# EAGLE design pic24rgbdin-01 (EAGLE 7.4.0)
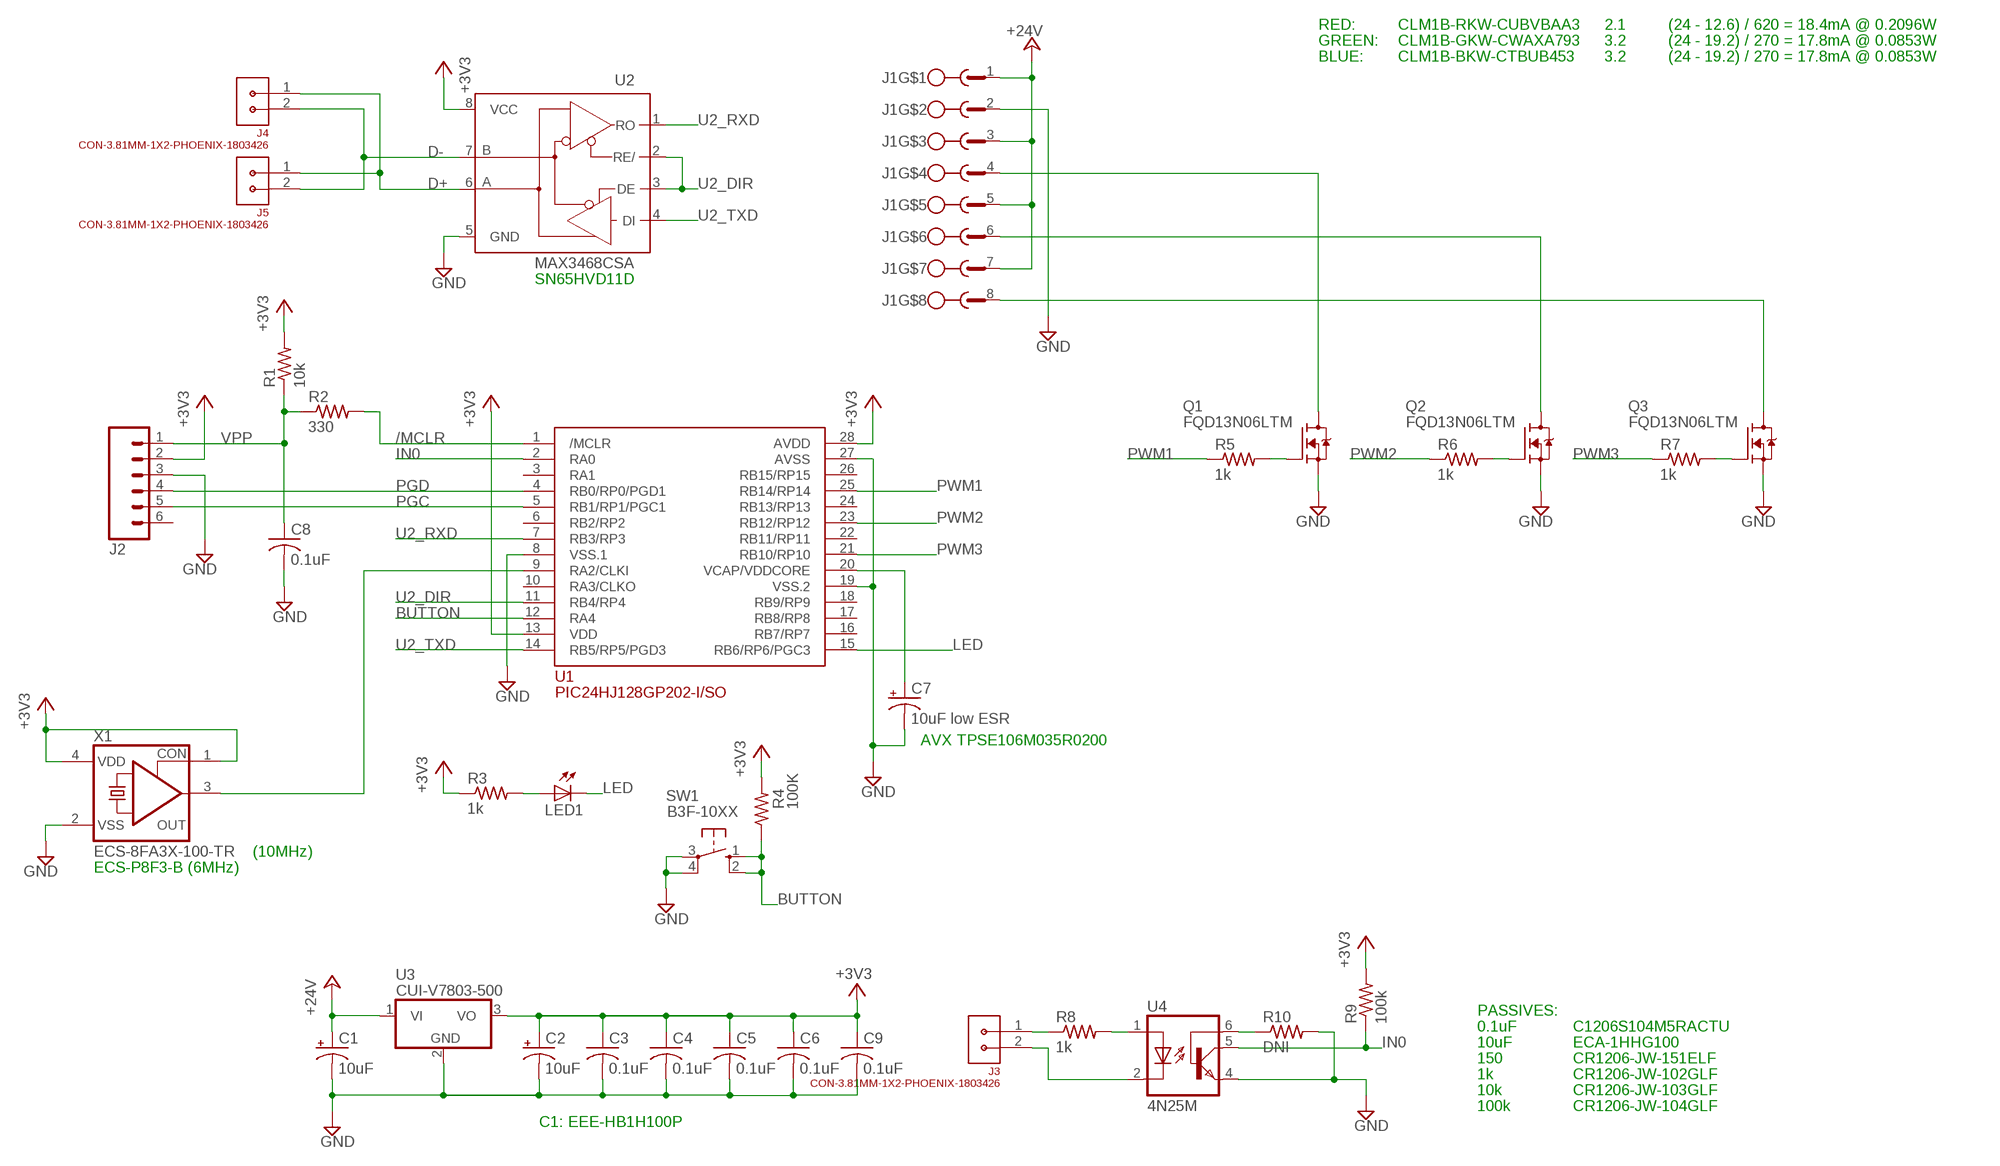
[diagram p0: schematic, sheet 1]

## Parts
C1  10uF  CPOL-USD  [PANASONIC_D]
C2  10uF  CPOL-USD  [PANASONIC_D]
C3  0.1uF  C-USC1206  [C1206]
C4  0.1uF  C-USC1206  [C1206]
C5  0.1uF  C-USC1206  [C1206]
C6  0.1uF  C-USC1206  [C1206]
C7  10uF low ESR  CPOL-USD/7343-31R  [D/7343-31R]
C8  0.1uF  C-USC1206  [C1206]
C9  0.1uF  C-USC1206  [C1206]
J1  CON-3.81MM-1X8-PHOENIX-HEADER-1803484  [CON-PHOENIX-1803484-3.81-1X8]
J2  M06SIP  [1X06]
J3  CON-3.81MM-1X2-PHOENIX-1803426  [CON-PHOENIX-1803426-3.81-1X2]
J4  CON-3.81MM-1X2-PHOENIX-1803426  [CON-PHOENIX-1803426-3.81-1X2]
J5  CON-3.81MM-1X2-PHOENIX-1803426  [CON-PHOENIX-1803426-3.81-1X2]
LED1  LED3MM  [LED3MM]
Q1  FQD13N06LTM  FQD13N06L  [TO252-D-PAK-FQD13N06LTM]
Q2  FQD13N06LTM  FQD13N06L  [TO252-D-PAK-FQD13N06LTM]
Q3  FQD13N06LTM  FQD13N06L  [TO252-D-PAK-FQD13N06LTM]
R1  10k  R-US_R1206  [R1206]
R2  330  R-US_R1206  [R1206]
R3  1k  R-US_R1206  [R1206]
R4  100K  R-US_M1206  [M1206]
R5  1k  R-US_R1206  [R1206]
R6  1k  R-US_R1206  [R1206]
R7  1k  R-US_R1206  [R1206]
R8  1k  R-US_R1206  [R1206]
R9  100k  R-US_R1206  [R1206]
R10  DNI  R-US_R1206  [R1206]
SW1  B3F-10XX  10-XX  [B3F-10XX]
U1  PIC24HJ128GP202-I/SO  [SO28W]
U2  MAX3468CSA  [SO08]
U3  CUI-V7803-500  [CUI-78XX-500]
U4  4N25M  [DIL06]
X1  ECS-8FA3X-100-TR  CRYSTAL_RES-1100S  [1100S]

## Nets
+3V3: C2.+ C3.1 C4.1 C5.1 C6.1 C9.1 J2.2 R1.2 R3.1 R4.2 R9.2 U1.13(VDD) U1.28(AVDD) U2.8(VCC) U3.3(VO) X1.1(CON) X1.4(VDD)
+24V: C1.+ J1.1 J1.3 J1.5 J1.7 U3.1(VI)
/MCLR: R2.2 U1.1(/MCLR)
BLUE: J1.8 Q3.P$4(D)
BUTTON: R4.1 SW1.1(S) SW1.2(S1) U1.12(RA4)
D+: J4.1 J5.1 U2.6(A)
D-: J4.2 J5.2 U2.7(B)
GND: C1.- C2.- C3.2 C4.2 C5.2 C6.2 C7.- C8.2 C9.2 J1.2 J2.3 Q1.P$3(S) Q2.P$3(S) Q3.P$3(S) R10.2 SW1.3(P) SW1.4(P1) U1.8(VSS.1) U1.19(VSS.2) U1.27(AVSS) U2.5(GND) U3.2(GND) U4.4(EMI) X1.2(VSS)
GREEN: J1.6 Q2.P$4(D)
IN0: R9.1 U1.2(RA0) U4.5(COL)
LED: LED1.K(C) U1.15(RB6/RP6/PGC3)
N$1: Q2.P$1(G) R6.2
N$2: Q3.P$1(G) R7.2
N$3: R8.2 U4.1(A)
N$4: C7.+ U1.20(VCAP/VDDCORE)
N$5: U1.9(RA2/CLKI) X1.3(OUT)
N$6: R10.1 U4.6(BAS)
N$7: J3.2 U4.2(C)
N$8: J3.1 R8.1
N$112: Q1.P$1(G) R5.2
N$115: LED1.A R3.2
PGC: J2.5 U1.5(RB1/RP1/PGC1)
PGD: J2.4 U1.4(RB0/RP0/PGD1)
PWM1: R5.1 U1.25(RB14/RP14)
PWM2: R6.1 U1.23(RB12/RP12)
PWM3: R7.1 U1.21(RB10/RP10)
RED: J1.4 Q1.P$4(D)
U2_DIR: U1.11(RB4/RP4) U2.2(RE/) U2.3(DE)
U2_RXD: U1.7(RB3/RP3) U2.1(RO)
U2_TXD: U1.14(RB5/RP5/PGD3) U2.4(DI)
VPP: C8.1 J2.1 R1.1 R2.1
Unconnected: J2.6 U1.3(RA1) U1.6(RB2/RP2) U1.10(RA3/CLKO) U1.16(RB7/RP7) U1.17(RB8/RP8) U1.18(RB9/RP9) U1.22(RB11/RP11) U1.24(RB13/RP13) U1.26(RB15/RP15)

## Notes on the sheet
- RED: | CLM1B-RKW-CUBVBAA3 | 2.1 | (24 - 12.6) / 620 = 18.4mA @ 0.2096W
- GREEN: | CLM1B-GKW-CWAXA793 | 3.2 | (24 - 19.2) / 270 = 17.8mA @ 0.0853W
- BLUE: | CLM1B-BKW-CTBUB453 | 3.2 | (24 - 19.2) / 270 = 17.8mA @ 0.0853W
- SN65HVD11D
- AVX TPSE106M035R0200
- (10MHz)
- ECS-P8F3-B (6MHz)
- PASSIVES:
- 0.1uF | C1206S104M5RACTU
- 10uF | ECA-1HHG100
- 150 | CR1206-JW-151ELF
- 1k | CR1206-JW-102GLF
- 10k | CR1206-JW-103GLF
- 100k | CR1206-JW-104GLF
- C1: EEE-HB1H100P

## Library data of the parts
C1 C2 C7 = rcl:CPOL-US: POLARIZED CAPACITOR, American symbol
C3-C6 C8 C9 = rcl:C-US: CAPACITOR, American symbol
J1 = 0GlenConnectors:CON-3.81MM-1X8-PHOENIX-HEADER-1803484
J2 = SparkFun-Connectors:M06: Header 6 Standard 6-pin 0.1" header. Use with straight break away headers (SKU : PRT-00116), right angle break away headers (PRT-00553), swiss pins (PRT-00743), machine pins (PRT-00117), and female headers (PRT-00115). Molex polarized connector foot print use with SKU : PRT-08094 with associated crimp pins and housings. NOTES ON THE VARIANTS LOCK and LOCK_LONGPADS... This footprint was designed to help hold the alignment of a through-hole component (i.e. 6-pin header) while soldering it into place. You may notice that each hole has been shifted either up or down by 0.005 of an inch from it's more standard position (which is a perfectly straight line). This slight alteration caused the pins (the squares in the middle) to touch the edges of the holes. Because they are alternating, it causes a "brace" to hold the component in place. 0.005 has proven to be the perfect amount of "off-center" position when using our standard breakaway headers. Although looks a little odd when you look at the bare footprint, once you have a header in there, the alteration is very hard to notice. Also,if you push a header all the way into place, it is covered up entirely on the bottom side. This idea of altering the position of holes to aid alignment will be further integrated into the Sparkfun Library for other footprints. It can help hold any component with 3 or more connection pins.
J3-J5 = 0GlenConnectors:CON-3.81MM-1X2-PHOENIX-1803426
LED1 = led:LED: LED OSRAM: - CHIPLED LG R971, LG N971, LY N971, LG Q971, LY Q971, LO R971, LY R971 LH N974, LH R974 LS Q976, LO Q976, LY Q976 LO Q996 - Hyper CHIPLED LW Q18S LB Q993, LB Q99A, LB R99A - SideLED LS A670, LO A670, LY A670, LG A670, LP A670 LB A673, LV A673, LT A673, LW A673 LH A674 LY A675 LS A676, LA A676, LO A676, LY A676, LW A676 LS A679, LY A679, LG A679 - Hyper Micro SIDELED® LS Y876, LA Y876, LO Y876, LY Y876 LT Y87S - SmartLED LW L88C, LW L88S LB L89C, LB L89S, LG L890 LS L89K, LO L89K, LY L89K LS L896, LA L896, LO L896, LY L896 - TOPLED LS T670, LO T670, LY T670, LG T670, LP T670 LSG T670, LSP T670, LSY T670, LOP T670, LYG T670 LG T671, LOG T671, LSG T671 LB T673, LV T673, LT T673, LW T673 LH T674 LS T676, LA T676, LO T676, LY T676, LB T676, LH T676, LSB T676, LW T676 LB T67C, LV T67C, LT T67C, LS T67K, LO T67K, LY T67K, LW E67C LS E67B, LA E67B, LO E67B, LY E67B, LB E67C, LV E67C, LT E67C LW T67C LS T679, LY T679, LG T679 LS T770, LO T770, LY T770, LG T770, LP T770 LB T773, LV T773, LT T773, LW T773 LH T774 LS E675, LA E675, LY E675, LS T675 LS T776, LA T776, LO T776, LY T776, LB T776 LHGB T686 LT T68C, LB T68C - Hyper Mini TOPLED® LB M676 - Mini TOPLED Santana® LG M470 LS M47K, LO M47K, LY M47K Source: http://www.osram.convergy.de LUXEON: - LUMILED® LXK2-PW12-R00, LXK2-PW12-S00, LXK2-PW14-U00, LXK2-PW14-V00 LXK2-PM12-R00, LXK2-PM12-S00, LXK2-PM14-U00 LXK2-PE12-Q00, LXK2-PE12-R00, LXK2-PE12-S00, LXK2-PE14-T00, LXK2-PE14-U00 LXK2-PB12-K00, LXK2-PB12-L00, LXK2-PB12-M00, LXK2-PB14-N00, LXK2-PB14-P00, LXK2-PB14-Q00 LXK2-PR12-L00, LXK2-PR12-M00, LXK2-PR14-Q00, LXK2-PR14-R00 LXK2-PD12-Q00, LXK2-PD12-R00, LXK2-PD12-S00 LXK2-PH12-R00, LXK2-PH12-S00 LXK2-PL12-P00, LXK2-PL12-Q00, LXK2-PL12-R00 Source: www.luxeon.com KINGBRIGHT: KA-3528ASYC Source: www.kingbright.com
Q1-Q3 = GlenPartsLibrary:FQD13N06L
R1-R10 = rcl:R-US_: RESISTOR, American symbol
SW1 = switch-omron:10-XX: OMRON SWITCH
U1 = GlenPartsLibrary:PIC24HJ128GP202-I/SO
U2 = maxim:MAX34*: +5V, Fail-Safe, 40Mbps, Profibus RS-485/RS-422 Transceivers Source: MAX3465-MAX3469.pdf; MPN: MAX3468CSA+; OC_FARNELL: unknown; OC_NEWARK: 76K6721
U3 = GlenPartsLibrary:CUI-V7803-500
U4 = optocoupler:4N*?M: General Purpose 6-Pin Phototransistor Optocouplers Source: http://www.fairchildsemi.com/ds/4N/4N35-M.pdf; MPN: 4N25-M; OC_FARNELL: 1021349; OC_NEWARK: 98K9084
X1 = crystal:CRYSTAL_RES-: CRYSTAL RESONATOR; OC_FARNELL: unknown; OC_NEWARK: unknown

## Board
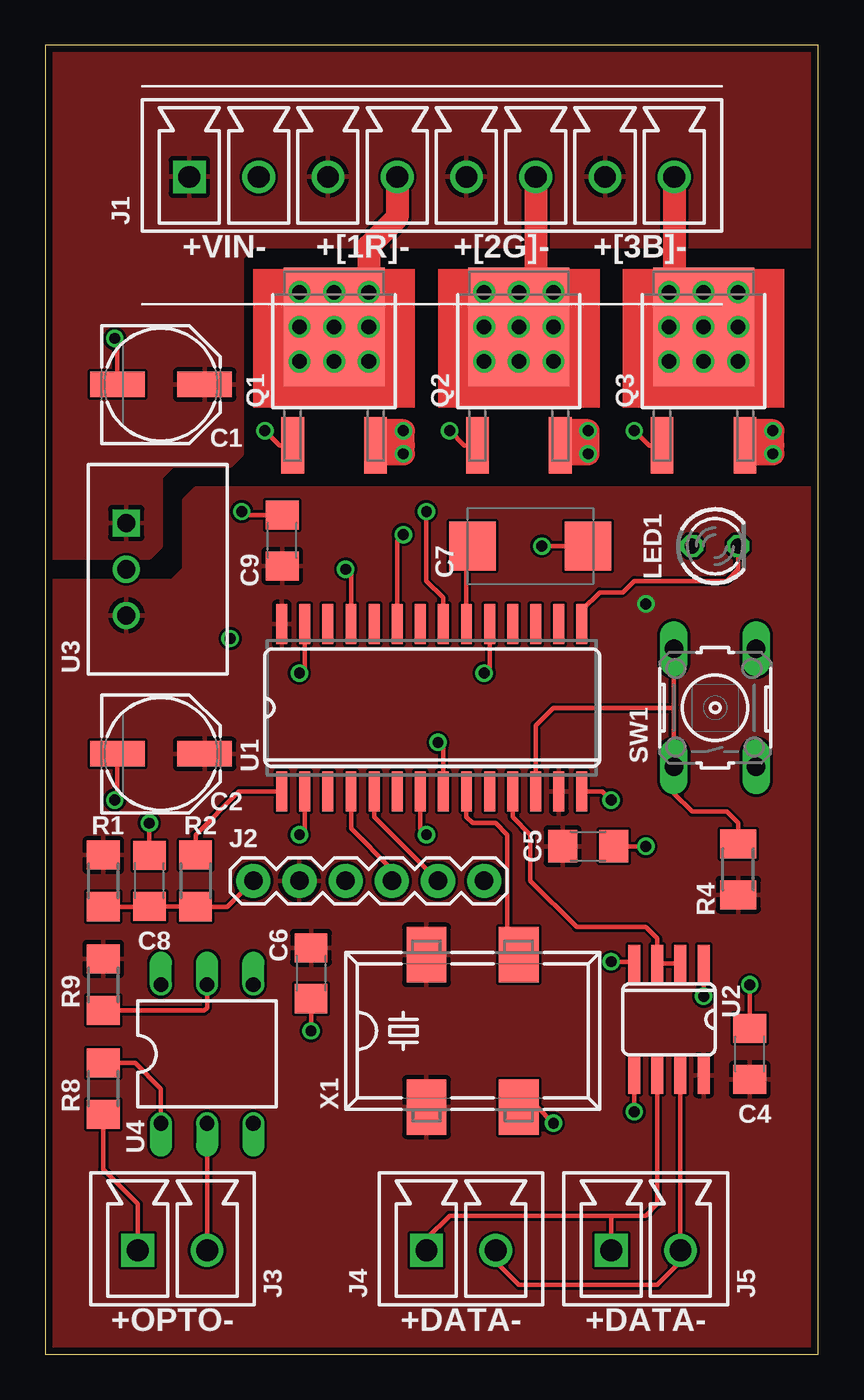
[diagram p1: board, top side]
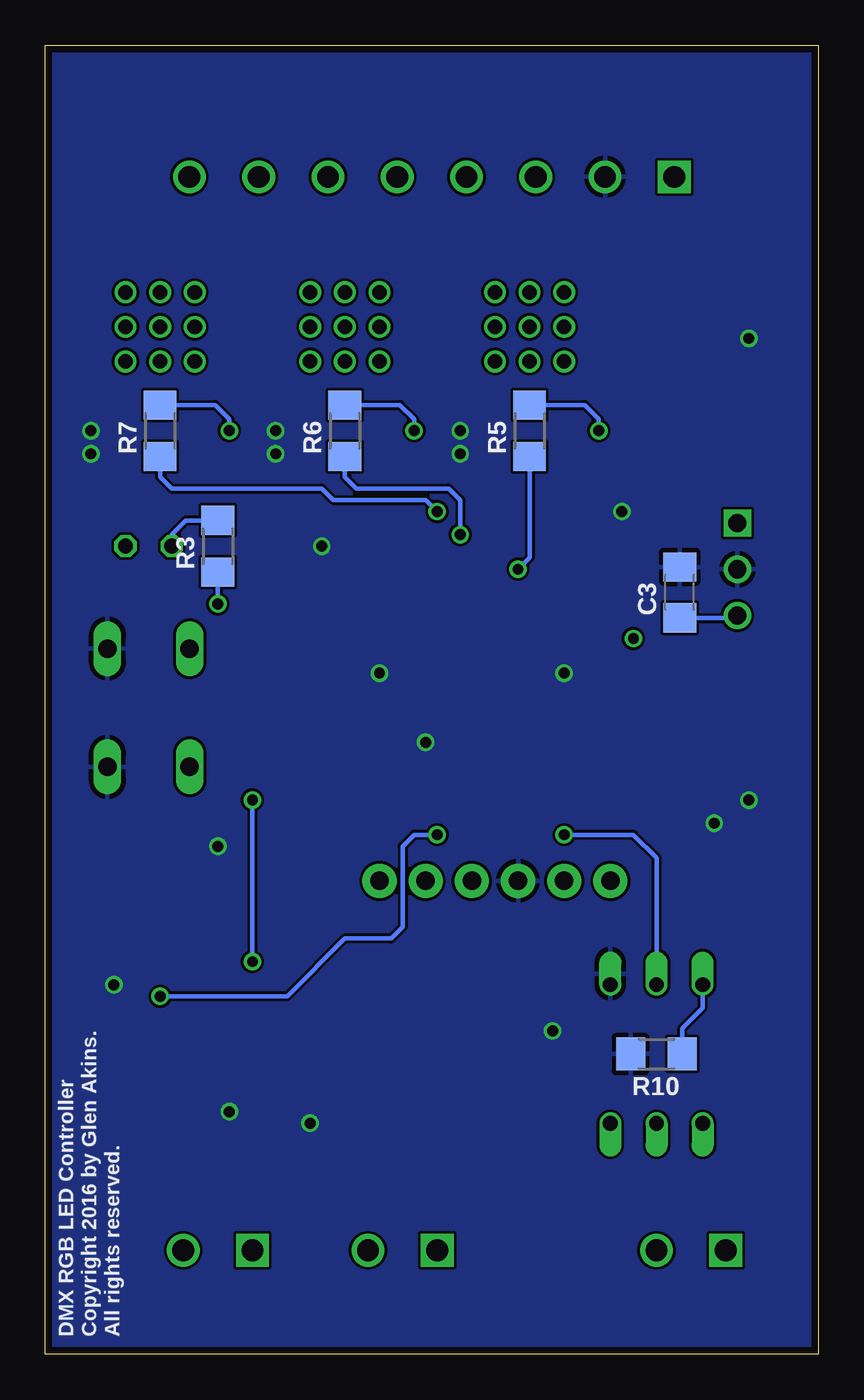
[diagram p2: board, bottom side, seen from below]

Size 42.5 x 72 mm. Coordinates in mm from the lower left corner, seen from the top.
Outline: 0,0 42.5,0 42.5,72 0,72 0,0
Copper layers (1*16): Top 0.0356mm / dielectric 1.5011mm / Bottom 0.0356mm
Design rules "LaenPCBOrder": minimum track width 6mil, minimum drill 13mil, track to track 6mil, track to pad 6mil, pad to pad 6mil, via to via 6mil, smd to smd 6mil, copper to edge 15mil, drill to drill 6mil, minimum pad ring 7mil, minimum via ring 7mil, stop-mask expansion 4mil, vias tented up to drill 0mil, thermal gap 10mil
tKeepout: area 0,0 to 42.5,1.5; area 0,70.5 to 42.5,72; area 0,1.5 to 1.5,70.5; area 41,1.5 to 42.5,70.5
bKeepout: area 0,0 to 42.5,3; area 0,69 to 42.5,72; area 0,3 to 2,69; area 40.5,3 to 42.5,69

### Footprints (pad centres in the part's own frame; a part is rotated, then mirrored left to right if it is on the bottom)
PANASONIC_D = smd 3 x 1.4: + 2.4,0; - -2.4,0
C1206 = smd 1.6 x 1.8: 1 -1.4,0; 2 1.4,0
D/7343-31R = smd 2.55 x 2.7: + 3.175,0; - -3.175,0
CON-PHOENIX-1803484-3.81-1X8 = drill 1.2 square: 1 0,0 | drill 1.2: 2 3.81,0; 3 7.62,0; 4 11.43,0; 5 15.24,0; 6 19.05,0; 7 22.86,0; 8 26.67,0
1X06 = drill 1.016 pad 1.88: 1 0,0; 2 2.54,0; 3 5.08,0; 4 7.62,0; 5 10.16,0; 6 12.7,0
CON-PHOENIX-1803426-3.81-1X2 = drill 1.2 square: 1 0,0 | drill 1.2: 2 3.81,0
LED3MM = drill 0.813 octagon: A -1.27,0; K 1.27,0
TO252-D-PAK-FQD13N06LTM = smd 1.25 x 3.104: P$1 -2.28,-6.527; P$3 2.28,-6.527 | smd 5.55 x 6.5: P$4 0,0
R1206 = smd 1.6 x 1.803: 1 -1.422,0; 2 1.422,0
M1206 = smd 1.6 x 2: 1 -1.4,0; 2 1.4,0
B3F-10XX = drill 1.016 long: 1 -3.251,2.261; 2 3.251,2.261; 3 -3.251,-2.261; 4 3.251,-2.261
SO28W = smd 0.6 x 2.2: 1 -8.255,-4.6; 2 -6.985,-4.6; 3 -5.715,-4.6; 4 -4.445,-4.6; 5 -3.175,-4.6; 6 -1.905,-4.6; 7 -0.635,-4.6; 8 0.635,-4.6; 9 1.905,-4.6; 10 3.175,-4.6; 11 4.445,-4.6; 12 5.715,-4.6; 13 6.985,-4.6; 14 8.255,-4.6; 15 8.255,4.6; 16 6.985,4.6; 17 5.715,4.6; 18 4.445,4.6; 19 3.175,4.6; 20 1.905,4.6; 21 0.635,4.6; 22 -0.635,4.6; 23 -1.905,4.6; 24 -3.175,4.6; 25 -4.445,4.6; 26 -5.715,4.6; 27 -6.985,4.6; 28 -8.255,4.6
SO08 = smd 0.66 x 2.032: 1 -1.905,-3.073; 2 -0.635,-3.073; 3 0.635,-3.073; 4 1.905,-3.073; 5 1.905,3.073; 6 0.635,3.073; 7 -0.635,3.073; 8 -1.905,3.073
CUI-78XX-500 = drill 1 square: 1 0,0 | drill 1: 2 2.54,0; 3 5.08,0
DIL06 = drill 0.813 offset: 1 -2.54,-3.81; 2 0,-3.81; 3 2.54,-3.81; 4 2.54,3.81; 5 0,3.81; 6 -2.54,3.81
1100S = smd 2.184 x 3.048: 1 -2.54,-4.191; 2 2.54,-4.191; 3 2.54,4.191; 4 -2.54,4.191

### Placement (x,y rotation side)
C1  6.35,53.34 0 top
C2  6.35,33.02 0 top
C3  7.62,41.91 90 bottom
C4  38.73,16.51 90 top
C5  29.84,27.94 0 top
C6  14.61,20.95 270 top
C7  26.67,44.45 180 top
C8  5.71,26.04 90 top
C9  13.02,44.77 90 top
J1  7.92,64.77 0 top
J2  11.43,26.04 0 top
J3  5.08,5.71 0 top
J4  20.95,5.71 0 top
J5  31.11,5.71 0 top
LED1  36.83,44.45 0 top
Q1  15.88,56.52 0 top
Q2  26.04,56.52 0 top
Q3  36.2,56.52 0 top
R1  3.17,26.04 90 top
R2  8.26,26.04 90 top
R3  33.02,44.45 90 bottom
R4  38.1,26.67 270 top
R5  15.88,50.8 90 bottom
R6  26.04,50.8 90 bottom
R7  36.2,50.8 90 bottom
R8  3.17,14.61 90 top
R9  3.17,20.32 90 top
R10  8.89,16.51 180 bottom
SW1  36.83,35.56 90 top
U1  21.25,35.56 0 top
U2  34.29,18.41 180 top
U3  4.45,45.72 270 top
U4  8.89,16.51 0 top
X1  23.5,17.78 0 top

### Tracks (layer width: path | path; a pad name or v marks a point on that pad's centre or on a via)
+3V3  (via drill 0.6)
  Bottom 0.254: C3.1 4.58,40.51 U3.3 | R3.1 v33.02,41.27
  pour Top: 0,0 42.5,0 42.5,47.62 8.26,47.62 7.62,46.99 7.62,43.18 6.99,42.55 0,42.55
+24V
  pour Top: 0,72 0,43.81 5.71,43.81 6.35,44.45 6.35,48.26 6.99,48.9 10.16,48.9 10.79,49.53 10.79,60.33 11.43,60.96 42.5,60.96 42.5,72
/MCLR
  Top 0.254: U1.1 10.64,30.96 8.26,28.57 R2.2
BLUE  (via drill 0.8)
  Top 0.61: 34.59,58.12 v34.29,58.42 Q3.P$4
  Top 1.27: J1.8 34.59,58.12
  other vias: 36.2,56.52
BUTTON
  Top 0.254: 34.57,35.56 SW1.1 34.57,30.84 35.56,29.84 37.47,29.84 38.1,29.21 R4.1 | 34.57,35.56 SW1.2 | U1.12 26.96,34.59 27.94,35.56 34.57,35.56
D+
  Top 0.254: J4.1 20.95,6.35 22.23,7.62 31.11,7.62 | J5.1 31.11,7.62 | 31.11,7.62 33.02,7.62 33.66,8.26 U2.6
D-
  Top 0.254: U2.7 J5.2 34.92,5.08 33.66,3.81 26.04,3.81 24.77,5.08 J4.2
GND  (via drill 0.6)
  Top 0.254: C4.2 v38.73,20.32 | X1.2 27.05,13.59 v27.94,12.7 | U2.5 v32.38,13.34 | C2.- 3.95,30.62 v3.81,30.48 | C1.- 3.95,55.74 v3.81,55.88 | C9.2 10.98,46.17 v10.79,46.35 | C7.- v27.3,44.45 | U1.27 14.27,37.76 v13.97,37.47 | U1.19 24.43,37.76 v24.13,37.47 | U1.8 21.89,33.36 v21.59,33.66 | C5.2 v33.02,27.94 | C8.2 v5.71,29.21 | C6.2 v14.61,17.78
  Top 1.27: Q1.P$3 19.68,49.99 | Q2.P$3 29.84,49.99 | Q3.P$3 40.01,49.99 | 19.68,49.99 v19.68,49.53 18.41,49.53 | 19.68,49.99 v19.68,50.8 18.41,50.8 | 29.84,49.99 v29.84,49.53 28.57,49.53 | 29.84,49.99 v29.84,50.8 28.57,50.8 | 40.01,49.99 v40.01,49.53 38.73,49.53 | 40.01,49.99 v40.01,50.8 38.73,50.8
  pour Bottom: 0,72 42.5,72 42.5,0 0,0
GREEN  (via drill 0.8)
  Top 0.61: 26.96,57.45 Q2.P$4
  Top 1.27: J1.6 26.96,57.45
  other vias: 26.04,56.52
IN0  (via drill 0.6)
  Top 0.254: R9.1 8.74,18.9 8.89,19.05 U4.5 | U1.2 14.27,28.87 v13.97,28.57
  Bottom 0.254: U4.5 8.89,27.3 10.16,28.57 v13.97,28.57
LED
  Top 0.254: U1.15 29.5,40.94 30.48,41.91 31.75,41.91 32.38,42.55 37.47,42.55 38.1,43.18 LED1.K
N$1  (via drill 0.6)
  Top 0.254: Q2.P$1 23.04,49.99 v22.23,50.8
  Bottom 0.254: R6.2 23.01,52.22 22.23,51.44 v22.23,50.8
N$2  (via drill 0.6)
  Top 0.254: Q3.P$1 33.2,49.99 v32.38,50.8
  Bottom 0.254: R7.2 33.17,52.22 32.38,51.44 v32.38,50.8
N$3
  Top 0.254: R8.2 4.93,16.03 6.35,14.61 U4.1
N$4
  Top 0.254: U1.20 23.16,44.11 C7.+
N$5
  Top 0.254: U1.9 23.16,29.55 23.5,29.21 24.77,29.21 25.4,28.57 25.4,22.23 25.78,22.23 X1.3
N$6
  Bottom 0.254: R10.1 7.47,17.93 6.35,19.05 U4.6
N$7
  Top 0.254: U4.2 J3.2
N$8
  Top 0.254: R8.1 3.17,10.16 5.08,8.26 J3.1
N$9  (via drill 0.8)
  other vias: 15.88,54.61
N$10  (via drill 0.8)
  other vias: 15.88,58.42
N$11  (via drill 0.8)
  other vias: 13.97,56.52
N$12  (via drill 0.8)
  other vias: 13.97,58.42
N$13  (via drill 0.8)
  other vias: 17.78,56.52
N$14  (via drill 0.8)
  other vias: 17.78,54.61
N$15  (via drill 0.8)
  other vias: 13.97,54.61
N$16  (via drill 0.8)
  other vias: 26.04,58.42
N$17  (via drill 0.8)
  other vias: 26.04,54.61
N$20  (via drill 0.8)
  other vias: 24.13,56.52
N$21  (via drill 0.8)
  other vias: 27.94,56.52
N$22  (via drill 0.8)
  other vias: 27.94,58.42
N$23  (via drill 0.8)
  other vias: 24.13,58.42
N$24  (via drill 0.8)
  other vias: 24.13,54.61
N$25  (via drill 0.8)
  other vias: 27.94,54.61
N$26  (via drill 0.8)
  other vias: 36.2,58.42
N$27  (via drill 0.8)
  other vias: 36.2,54.61
N$28  (via drill 0.8)
  other vias: 38.1,56.52
N$29  (via drill 0.8)
  other vias: 38.1,58.42
N$30  (via drill 0.8)
  other vias: 34.29,56.52
N$31  (via drill 0.8)
  other vias: 34.29,54.61
N$32  (via drill 0.8)
  other vias: 38.1,54.61
N$33  (via drill 0.6)
  other vias: 10.16,39.37
N$112  (via drill 0.6)
  Top 0.254: Q1.P$1 12.88,49.99 v12.06,50.8
  Bottom 0.254: R5.2 12.85,52.22 12.06,51.44 v12.06,50.8
N$115
  Bottom 0.254: R3.2 34.77,45.87 35.56,45.09 LED1.A
PGC
  Top 0.254: U1.5 18.07,29.55 J2.5
PGD
  Top 0.254: U1.4 16.8,28.91 19.05,26.67 J2.4
PWM1  (via drill 0.6)
  Top 0.254: U1.25 16.8,42.88 v16.51,43.18
  Bottom 0.254: R5.1 15.88,43.81 v16.51,43.18
PWM2  (via drill 0.6)
  Top 0.254: U1.23 19.34,44.74 v19.68,45.09
  Bottom 0.254: R6.1 26.04,48.26 25.4,47.62 20.32,47.62 19.68,46.99 v19.68,45.09
PWM3  (via drill 0.6)
  Top 0.254: U1.21 21.89,41.62 20.95,42.55 v20.95,46.35
  Bottom 0.254: R7.1 36.2,48.26 35.56,47.62 27.3,47.62 26.67,46.99 21.59,46.99 v20.95,46.35
RED  (via drill 0.8)
  Top 0.61: v17.78,58.42 Q1.P$4
  Top 1.27: J1.4 19.34,62.52 17.78,60.96 v17.78,58.42
  other vias: 15.88,56.52
U2_DIR
  Top 0.254: U1.11 25.7,29.55 26.67,28.57 26.67,26.04 29.21,23.5 33.02,23.5 33.66,22.86 U2.3 U2.2
U2_RXD  (via drill 0.6)
  Top 0.254: U1.7 20.61,28.91 v20.95,28.57 | v36.2,19.68 U2.1
  Bottom 0.254: v20.95,28.57 22.23,28.57 22.86,27.94 22.86,23.5 23.5,22.86 26.04,22.86 29.21,19.68 v36.2,19.68
U2_TXD  (via drill 0.6)
  Top 0.254: U1.14 30.64,30.96 v31.11,30.48 | v31.11,21.59 32.28,21.59 U2.4
  Bottom 0.254: v31.11,30.48 v31.11,21.59
VPP
  Top 0.254: R1.1 5.69,24.61 C8.1 8.23,24.64 R2.1 10.01,24.61 J2.1
(copper drawn outside any net)
  shapes: Top area x3

### Text on the board
_tsilk: +VIN- | +[1R]- | +[2G]- | +[3B]- | +OPTO- | +DATA- | +DATA-
_bsilk: R5 | R6 | R7 | R3 | C3 | R10 | All rights reserved. | Copyright 2016 by Glen Akins. | DMX RGB LED Controller